# EAGLE design watch_pcb (EAGLE 9.7.0)

## Sheet 1 of 4: FTDI Serial and Battery Charger
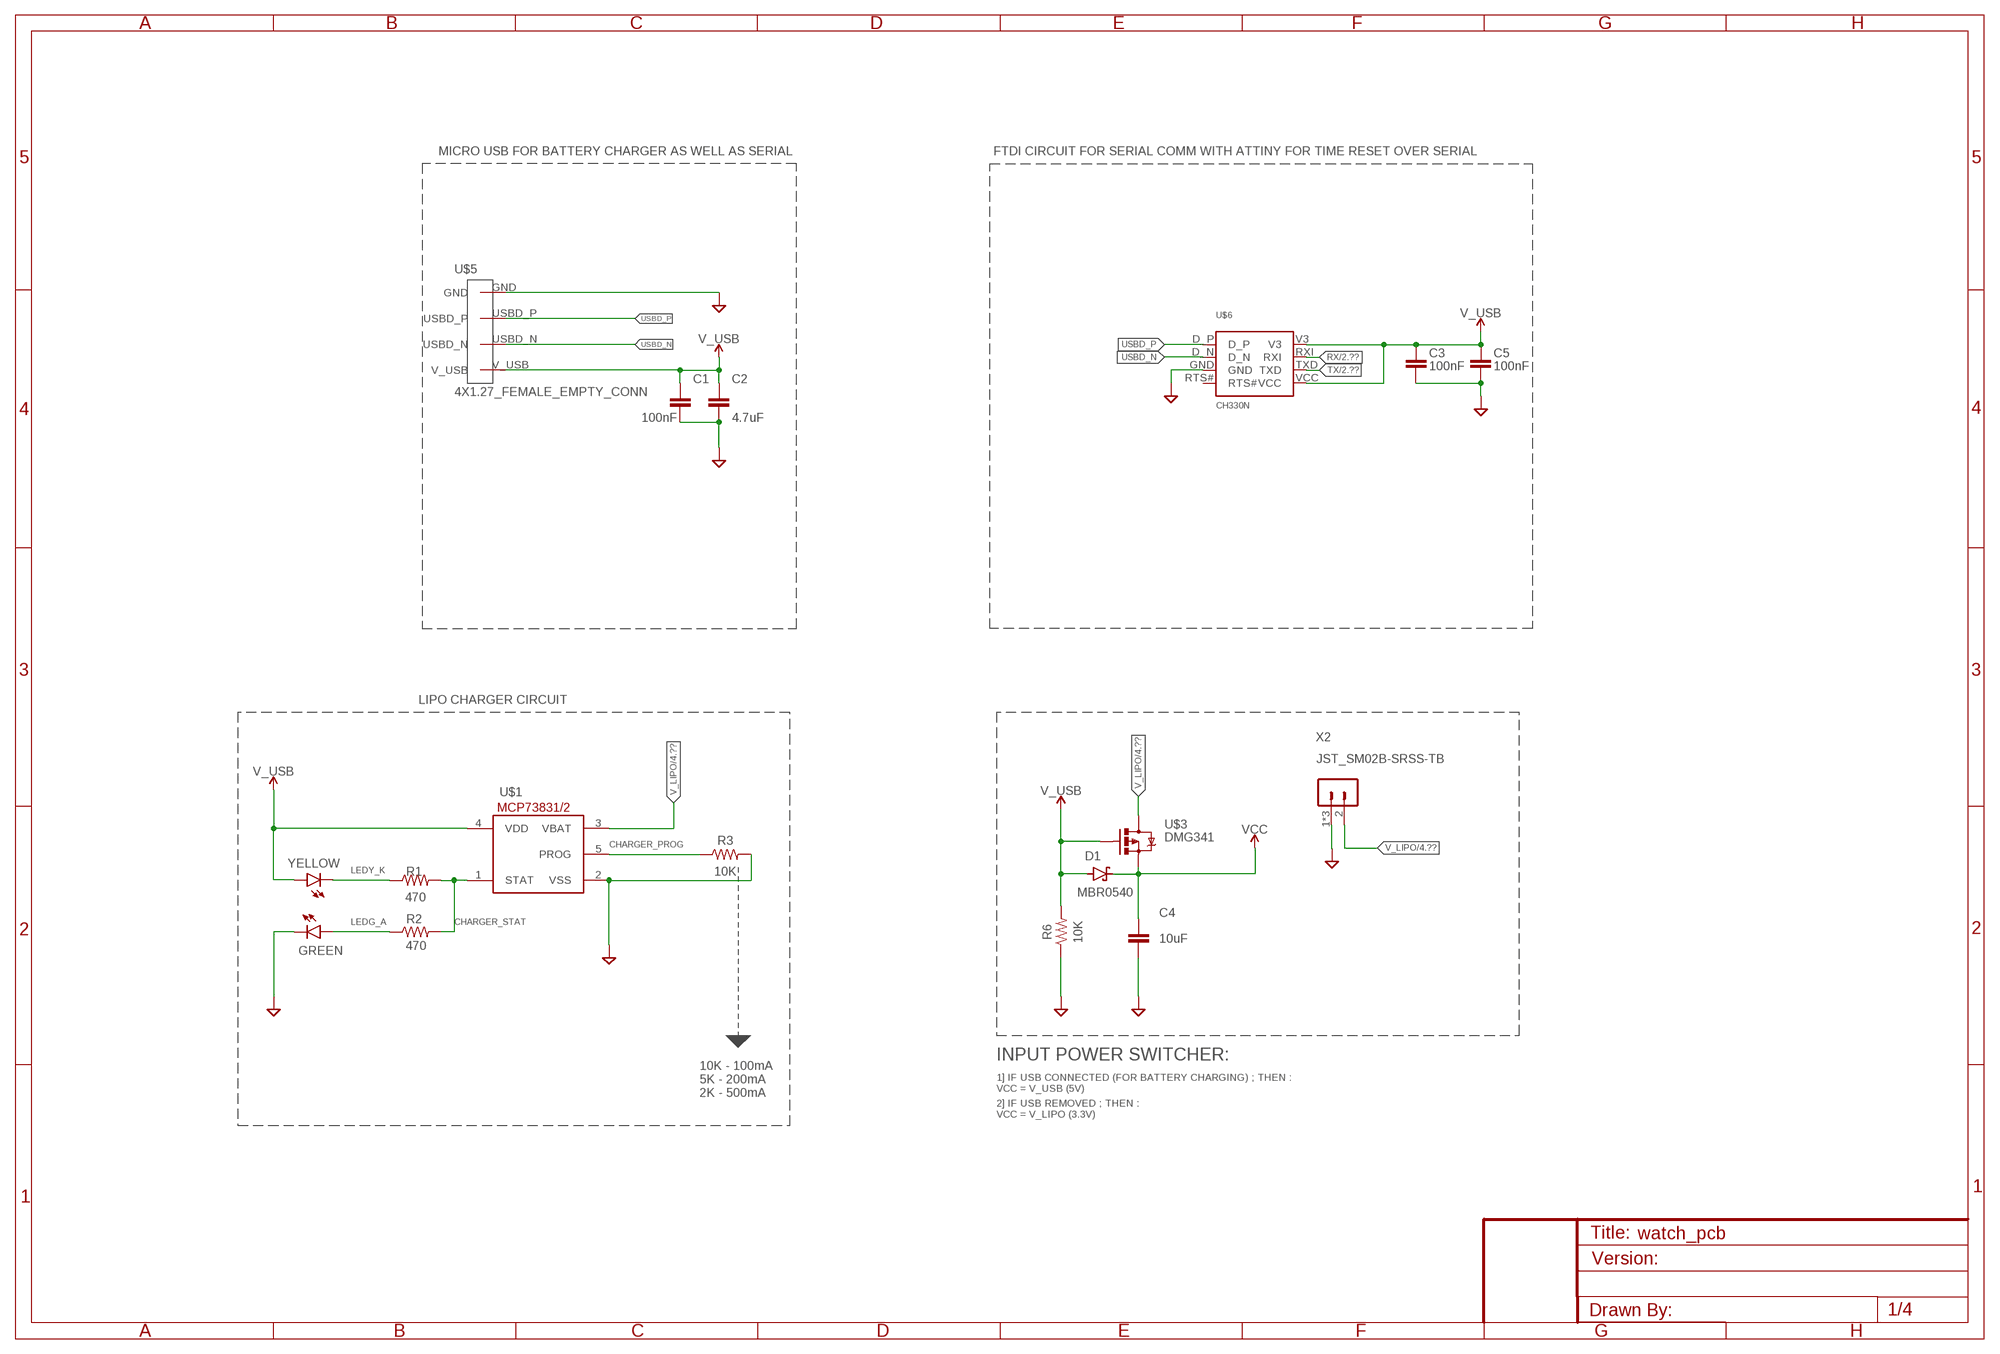
[diagram p0: schematic, sheet 1]

### Parts
C1  100nF  C_CHIP-0402(1005-METRIC)  [CAPC1005X60]
C2  4.7uF  C_CHIP-0402(1005-METRIC)  [CAPC1005X60]
C3  100nF  C_CHIP-0402(1005-METRIC)  [CAPC1005X60]
C4  10uF  C_CHIP-0402(1005-METRIC)  [CAPC1005X60]
C5  100nF  C_CHIP-0402(1005-METRIC)  [CAPC1005X60]
D1  MBR0540  MBR0520LT1G  [SOD-123]
GREEN  GREEN  2MMLED_GREEN  [2MMLED_GREEN]
R1  470  R-US_CHIP-0402(1005-METRIC)  [RESC1005X40]
R2  470  R-US_CHIP-0402(1005-METRIC)  [RESC1005X40]
R3  10K  R-US_CHIP-0402(1005-METRIC)  [RESC1005X40]
R6  10K  R-US_CHIP-0402(1005-METRIC)  [RESC1005X40]
U$1  MCP73831/2_LIPO_CHARGER  [MCP73831_SOT23-5L]
U$3  DMG341  DMG341-P_CHANNEL_MOSFET-SOT23  [DMG341-P_CHANNEL_MOSFET-SOT23]
U$5  4X1.27_FEMALE_EMPTY_CONN  [4X1.27_FEMALE_EMPTY_CONN-BACKUP]
U$6  CH330N  [CH330N]
X2  JST_SM02B-SRSS-TB  [JST-SM02B-SRSS-TB]
YELLOW  ORANGE  2MMLED_YELLOW  [2MMLED_YELLOW]

### Nets
CHARGER_PROG: R3.1 U$1.5(PROG)
CHARGER_STAT: R1.2 R2.2 U$1.1(STAT)
GND: C1.2 C2.2 C3.2 C4.2 C5.2 GREEN.K(C) R3.2 R6.1 U$1.2(VSS) U$5.GND U$6.GND X2.1 X2.M1 X2.M2 ; also sheet 2,3,4
LEDG_A: GREEN.A R2.1
LEDY_K: R1.1 YELLOW.K(C)
RX: U$6.RXI ; also sheet 2
TX: U$6.TXD ; also sheet 2
USBD_N: U$5.USBD_N U$6.D_N
USBD_P: U$5.USBD_P U$6.D_P
V_LIPO: U$1.3(VBAT) U$3.3(D) X2.2 ; also sheet 4
V_USB: C1.1 C2.1 C3.1 C5.1 D1.A R6.2 U$1.4(VDD) U$3.1(G) U$5.V_USB U$6.V3 U$6.VCC YELLOW.A ; also sheet 4
VCC: C4.1 D1.C U$3.2(S) ; also sheet 2,3,4
Unconnected: U$6.RTS#

### Notes on the sheet
- MICRO USB FOR BATTERY CHARGER AS WELL AS SERIAL | FTDI CIRCUIT FOR SERIAL COMM WITH ATTINY FOR TIME RESET OVER SERIAL
- LIPO CHARGER CIRCUIT
- INPUT POWER SWITCHER:
- 10K - 100mA
  5K - 200mA
  2K - 500mA
- 1] IF USB CONNECTED (FOR BATTERY CHARGING) ; THEN :
  VCC = V_USB (5V)
- 2] IF USB REMOVED ; THEN :
  VCC = V_LIPO (3.3V)

## Sheet 2 of 4
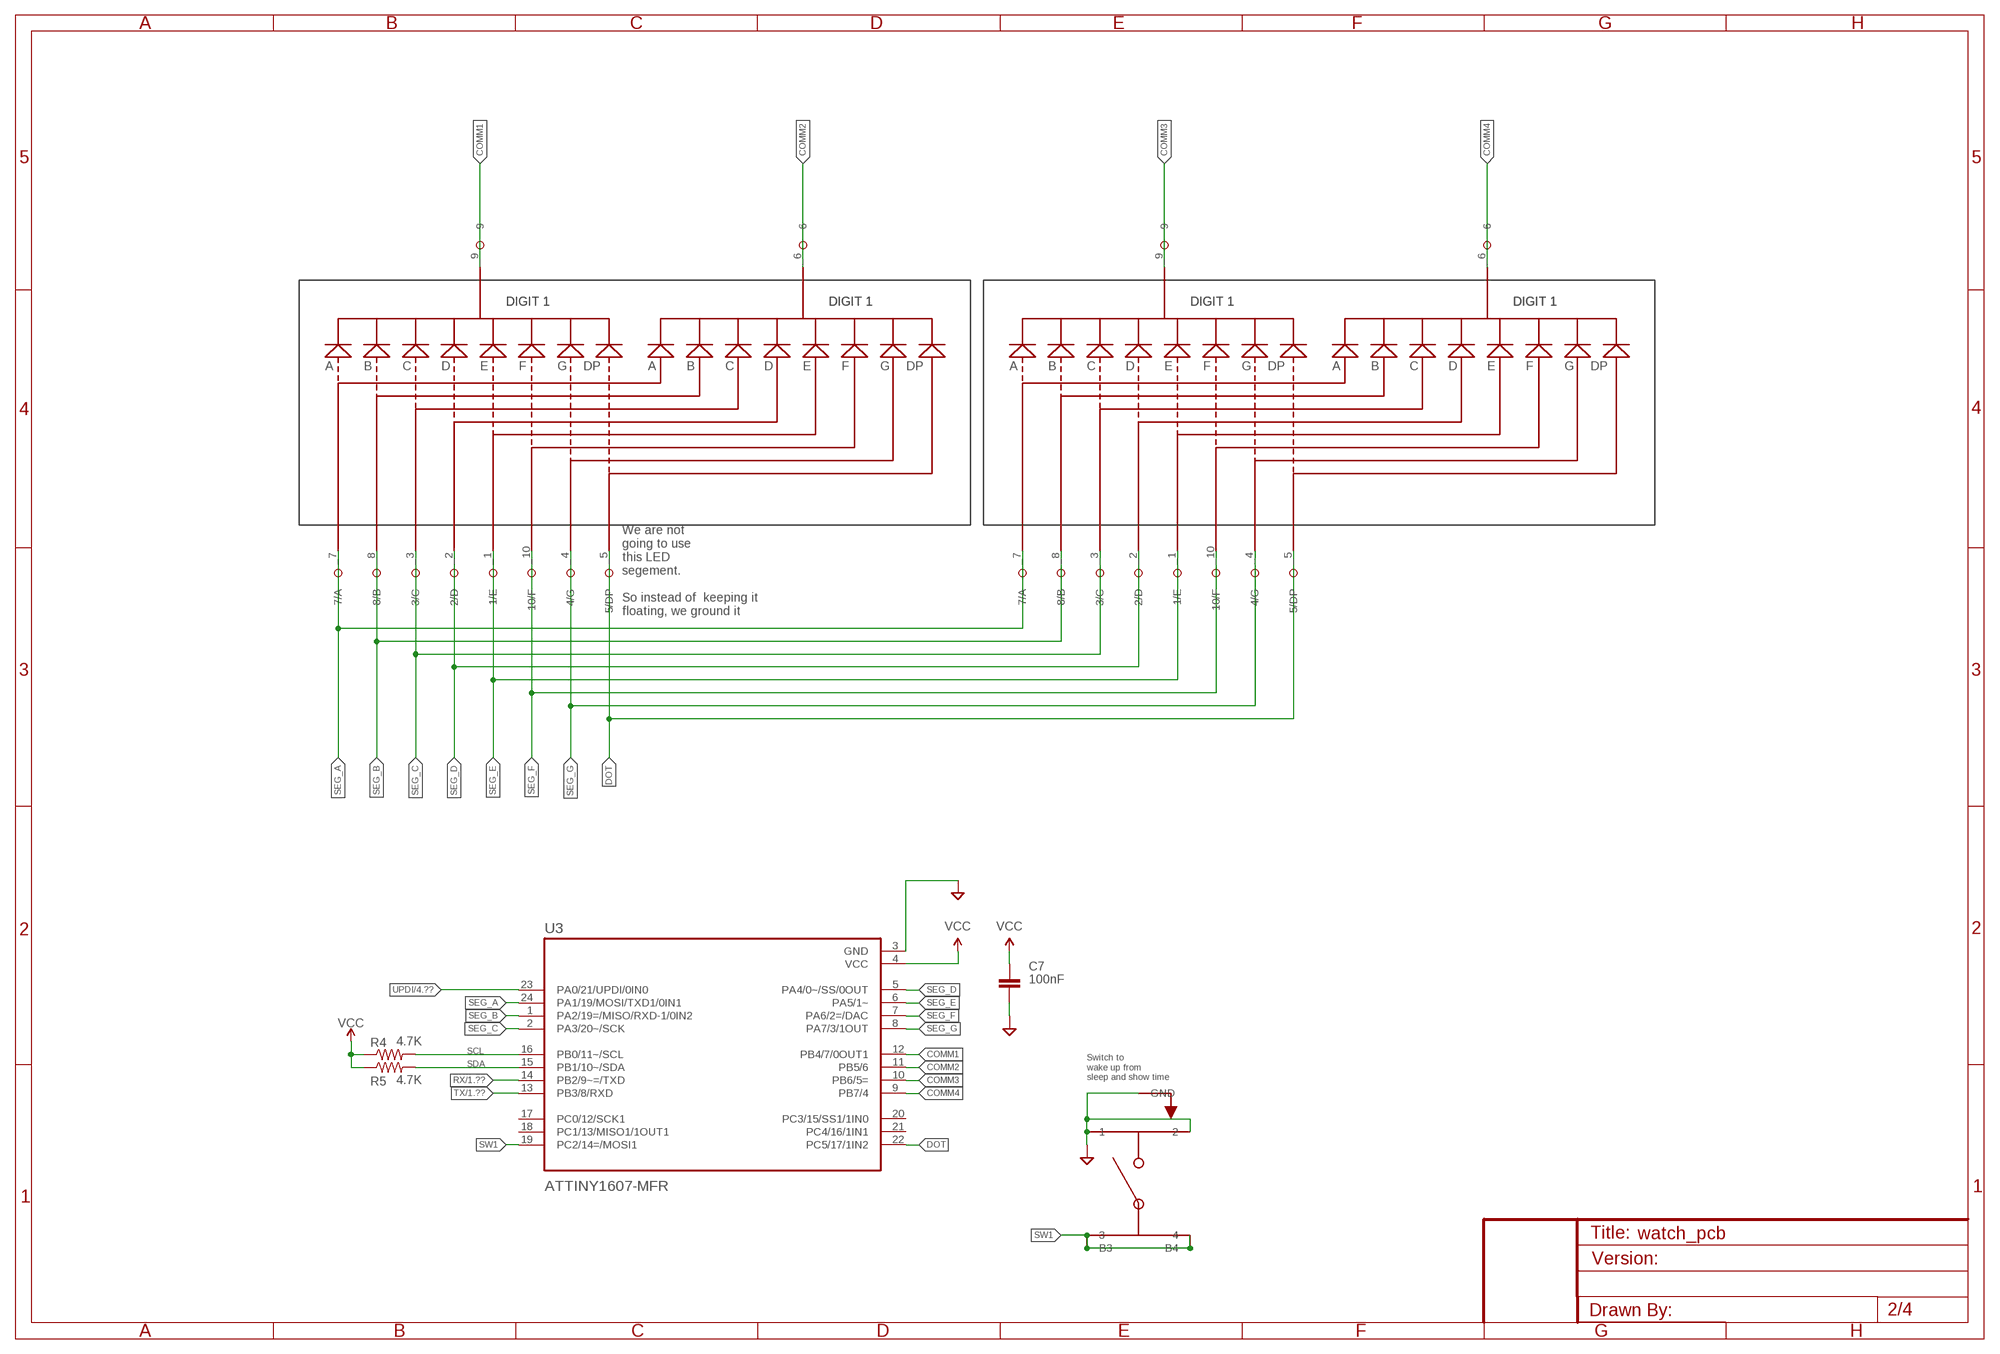
[diagram p1: schematic, sheet 2]

### Parts
BOT  0.28-2DIGIT-7SEGEMNT  [2_DIGIT_0.28]
C7  100nF  C_CHIP-0402(1005-METRIC)  [CAPC1005X60]
R4  4.7K  ADAFRUIT_R-US_R0402  [ADAFRUIT_R0402]
R5  4.7K  ADAFRUIT_R-US_R0402  [ADAFRUIT_R0402]
TOP  0.28-2DIGIT-7SEGEMNT  [2_DIGIT_0.28]
U3  ATTINY1607-MFR  ATTINY1607-MNR  [QFN50P400X400X90-25N]
U$4  PTS840ESDPMSMTRLF  [PTS840ESDPMSMTRLF]

### Nets
COMM1: TOP._9 U3.12(PB4/7/0OUT1)
COMM2: TOP._6 U3.11(PB5/6)
COMM3: BOT._9 U3.10(PB6/5=)
COMM4: BOT._6 U3.9(PB7/4)
DOT: BOT._5(5/DP) TOP._5(5/DP) U3.22(PC5/17/1IN2)
GND: C7.2 U3.3(GND) U$4.1 U$4.2 U$4.5(GND) ; also sheet 1,3,4
RX: U3.14(PB2/9~=/TXD) ; also sheet 1
SCL: R4.2 U3.16(PB0/11~/SCL) ; also sheet 3
SDA: R5.2 U3.15(PB1/10~/SDA) ; also sheet 3
SEG_A: BOT._7(7/A) TOP._7(7/A) U3.24(PA1/19/MOSI/TXD1/0IN1)
SEG_B: BOT._8(8/B) TOP._8(8/B) U3.1(PA2/19=/MISO/RXD-1/0IN2)
SEG_C: BOT._3(3/C) TOP._3(3/C) U3.2(PA3/20~/SCK)
SEG_D: BOT._2(2/D) TOP._2(2/D) U3.5(PA4/0~/SS/0OUT)
SEG_E: BOT._1(1/E) TOP._1(1/E) U3.6(PA5/1~)
SEG_F: BOT._10(10/F) TOP._10(10/F) U3.7(PA6/2=/DAC)
SEG_G: BOT._4(4/G) TOP._4(4/G) U3.8(PA7/3/1OUT)
SW1: U3.19(PC2/14=/MOSI1) U$4.3 U$4.4 U$4.B3 U$4.B4
TX: U3.13(PB3/8/RXD) ; also sheet 1
UPDI: U3.23(PA0/21/UPDI/0IN0) ; also sheet 4
VCC: C7.1 R4.1 R5.1 U3.4(VCC) ; also sheet 1,3,4
Unconnected: U3.17(PC0/12/SCK1) U3.18(PC1/13/MISO1/1OUT1) U3.20(PC3/15/SS1/1IN0) U3.21(PC4/16/1IN1)

### Notes on the sheet
- We are not
  going to use
  this LED
  segement. 
  
  So instead of  keeping it
  floating, we ground it
- Switch to 
  wake up from 
  sleep and show time

## Sheet 3 of 4: RV8803 RTC
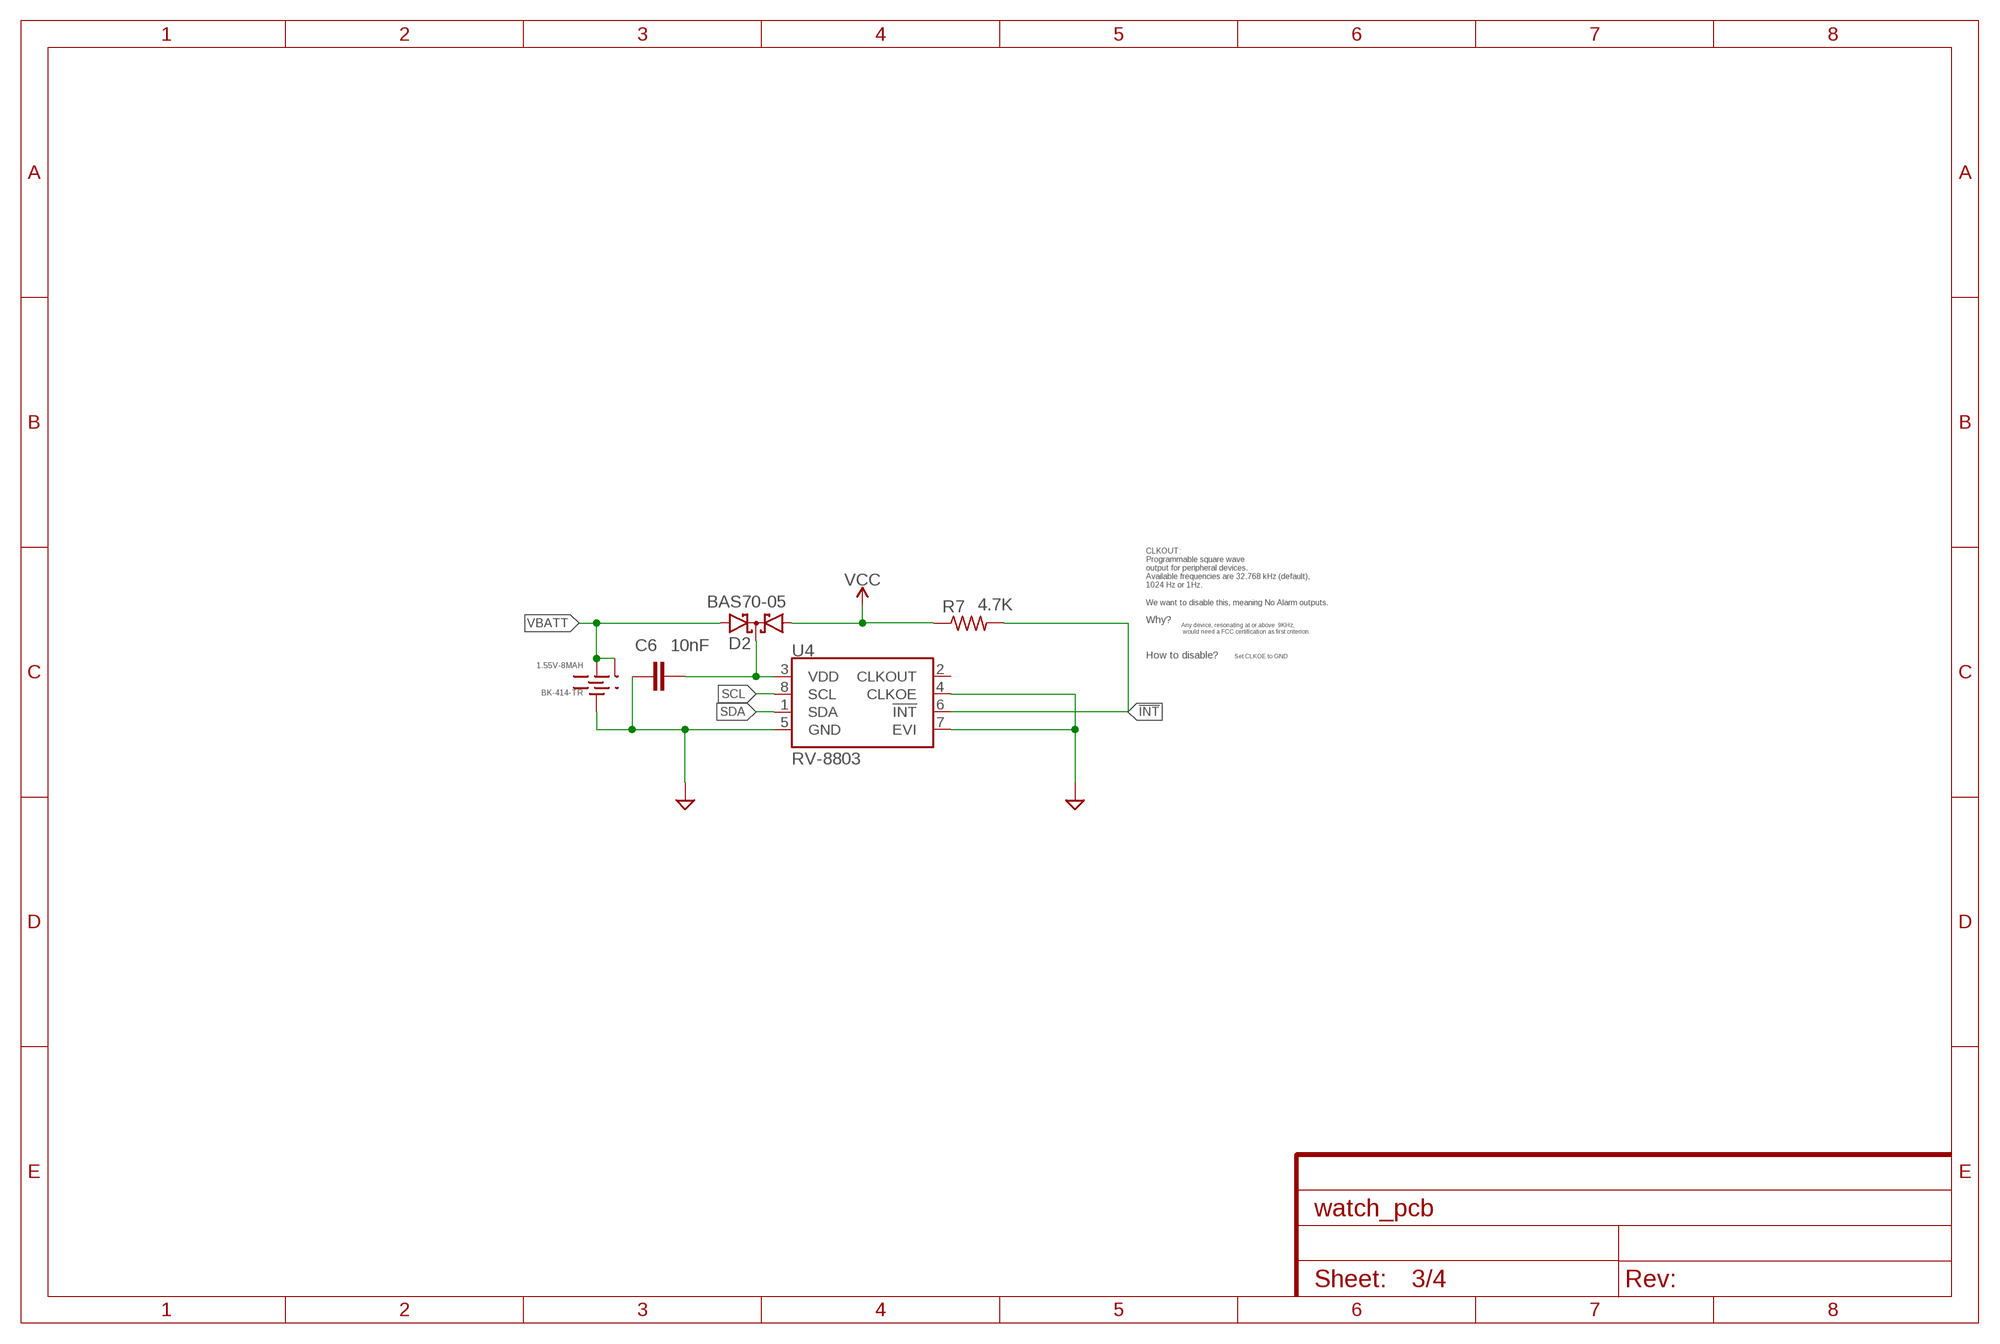
[diagram p2: schematic, sheet 3]

### Parts
1.55V-8MAH  BK-414-TR  [BK-414-TR]
C6  10nF  10NF-0402T-25V-10%  [0402-TIGHT]
D2  BAS70-05  [SOT23]
R7  4.7K  ADAFRUIT_R-US_R0402  [ADAFRUIT_R0402]
U4  RV-8803  [RV-3028]

### Nets
!INT: R7.2 U4.6(!INT)
GND: 1.55V-8MAH.-(_GND) C6.2 U4.4(CLKOE) U4.5(GND) U4.7(EVI) ; also sheet 1,2,4
SCL: U4.8(SCL) ; also sheet 2
SDA: U4.1(SDA) ; also sheet 2
VBATT: 1.55V-8MAH.1+(VOUT) 1.55V-8MAH.2+(VOUT2) D2.2(A2)
VCC: D2.1(A1) R7.1 ; also sheet 1,2,4
VDD1: C6.1 D2.3(C) U4.3(VDD)
Unconnected: U4.2(CLKOUT)

### Notes on the sheet
- CLKOUT: 
  Programmable square wave 
  output for peripheral devices.
  Available frequencies are 32.768 kHz (default),
  1024 Hz or 1Hz.
- We want to disable this, meaning No Alarm outputs.
- Why?
- Any device, resonating at or above  9KHz,
   would need a FCC certification as first criterion.
- How to disable? | Set CLKOE to GND

## Sheet 4 of 4
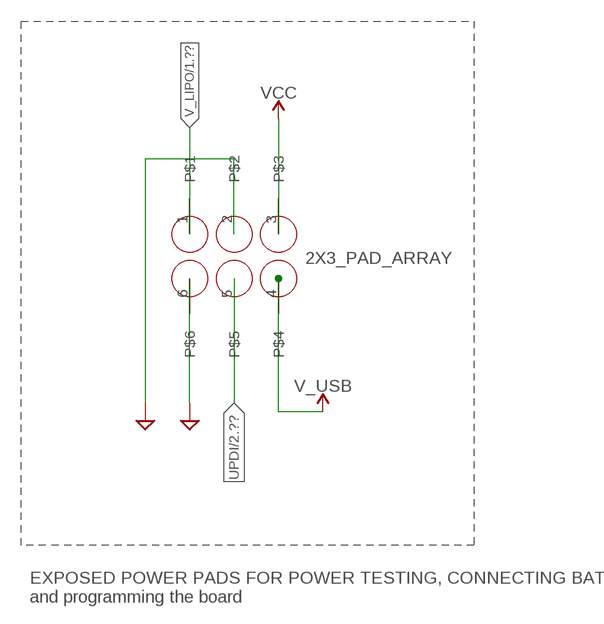
[diagram p3: schematic, sheet 4]

### Parts
U$2  2X3_PAD_ARRAY  [2X3_PAD_ARRAY]

### Nets
GND: U$2.2 U$2.6 ; also sheet 1,2,3
UPDI: U$2.5 ; also sheet 2
V_LIPO: U$2.1 ; also sheet 1
V_USB: U$2.4 ; also sheet 1
VCC: U$2.3 ; also sheet 1,2,3

### Notes on the sheet
- EXPOSED POWER PADS FOR POWER TESTING, CONNECTING BATTERY 
  and programming the board

## Library data of the parts
1.55V-8MAH = MY_CLOCK_LIB_COMPONENTS:BK-414-TR
BOT TOP = MY_CLOCK_LIB_COMPONENTS:0.28-2DIGIT-7SEGEMNT
C1-C5 C7 = MY_CAP_LIB:C: Capacitor - Generic; CATEGORY: Capacitor
C6 = SparkFun-Capacitors:10NF: 0.01uF/10nF/10,000pF ceramic capacitors A capacitor is a passive two-terminal electrical component used to store electrical energy temporarily in an electric field. CAP-09321; PROD_ID: CAP-14847
D1 = Diodes:MBR0520LT1G: DIODE SCHOTTKY 20V 500MA SOD123 Manufacturer's datasheet <https://www.onsemi.com/pub/Collateral/MBR0520LT1-D.PDF>; CREATED_BY: PCBLayout.com; DIGIKEY_PART_NUMBER: MBR0520LT1GOSTR-ND; MANUFACTURER: ON Semiconductor; MPN: MBR0520LT1G; PACKAGE: SOD-123
D2 = BAS_40_05:BAS70-05: Silicon Schottky Diodes General-purpose diode for high-speed switching
GREEN = MY_CLOCK_LIB_COMPONENTS:2MMLED_GREEN
R1-R3 R6 = resistor:R-US: Resistor Fixed - ANSI; CATEGORY: Resistor; SUB-CATEGORY: Fixed
R4 R5 R7 = ARDUINO_3V_TTL_INTERFACE_2_PI:ADAFRUIT_R-US_: RESISTOR, American symbol
U3 = ATTINY1607-MNR:ATTINY1607-MNR: None Check prices <https://pricing.snapeda.com/parts/ATTINY1607-MNR/Microchip%20Technology/view-part?ref=eda>; AVAILABILITY: In Stock; DESCRIPTION: AVR AVR® ATtiny, Functional Safety (FuSa) Microcontroller IC 8-Bit 20MHz 16KB (16K x 8) FLASH 24-VQFN (4x4); MF: Microchip Technology; MP: ATTINY1607-MNR; PACKAGE: VFQFN-24 Microchip Technology; PRICE: None
U4 = RV-8803:RV-8803: Micro Crystal RV-8803 - Temperature compensated RTC Ultra accurate plus/minus 3PPM I2C RTC. Temperature compensated crystal for low drift; PROD_ID: IC-14828
U$1 = MY_CLOCK_LIB_COMPONENTS:MCP73831/2_LIPO_CHARGER
U$2 = MY_CLOCK_LIB_COMPONENTS:2X3_PAD_ARRAY
U$3 = MY_CLOCK_LIB_COMPONENTS:DMG341-P_CHANNEL_MOSFET-SOT23
U$4 = MY_CLOCK_LIB_COMPONENTS:PTS840ESDPMSMTRLF
U$5 = MY_CLOCK_LIB_COMPONENTS:4X1.27_FEMALE_EMPTY_CONN
U$6 = MY_CLOCK_LIB_COMPONENTS:CH330N
X2 = MY_CLOCK_LIB_COMPONENTS:JST_SM02B-SRSS-TB
YELLOW = MY_CLOCK_LIB_COMPONENTS:2MMLED_YELLOW

## Board
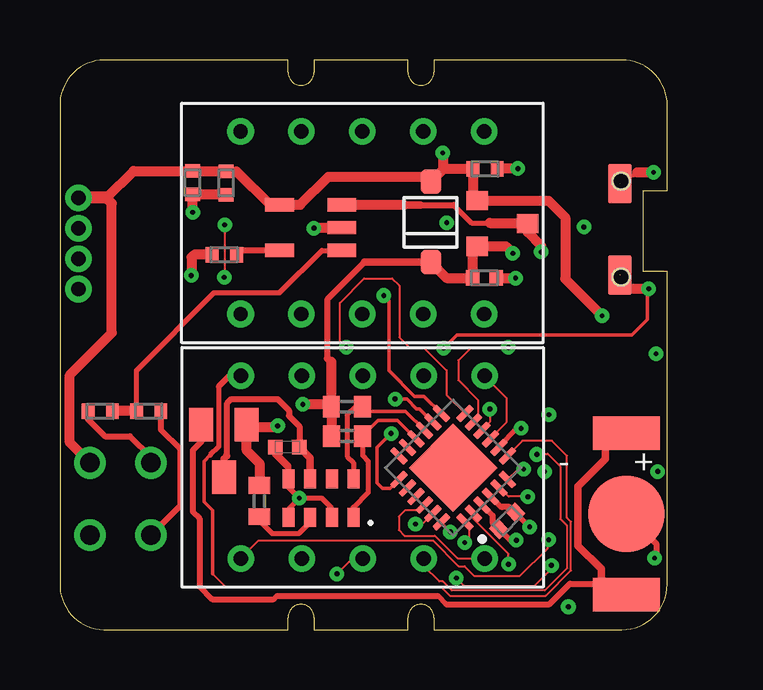
[diagram p4: board, top side]
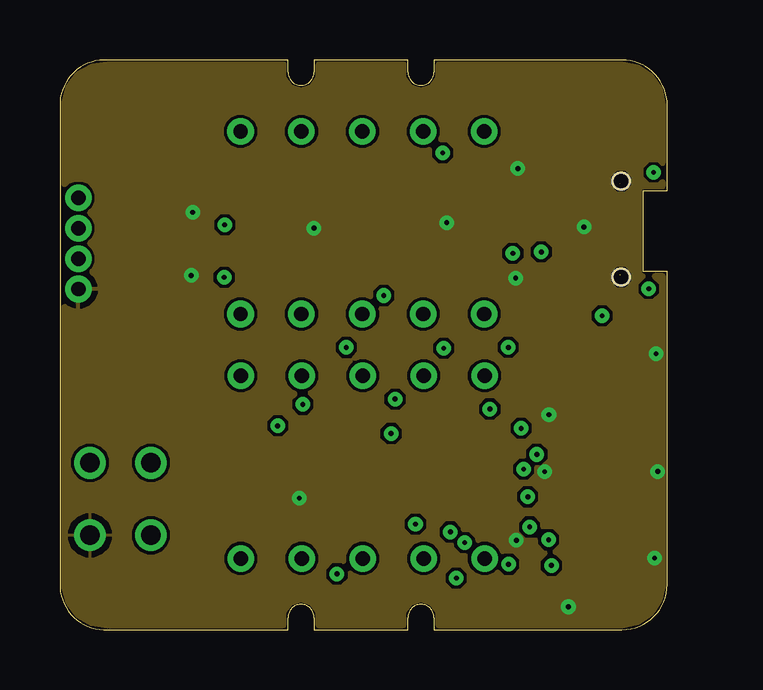
[diagram p5: board, inner layer pw_plane_t]
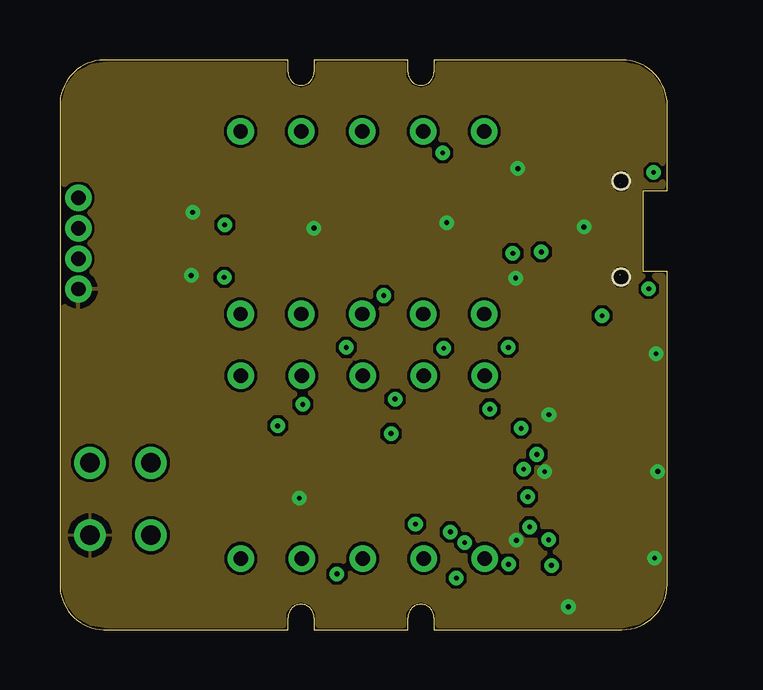
[diagram p6: board, inner layer pwr_plane_b]
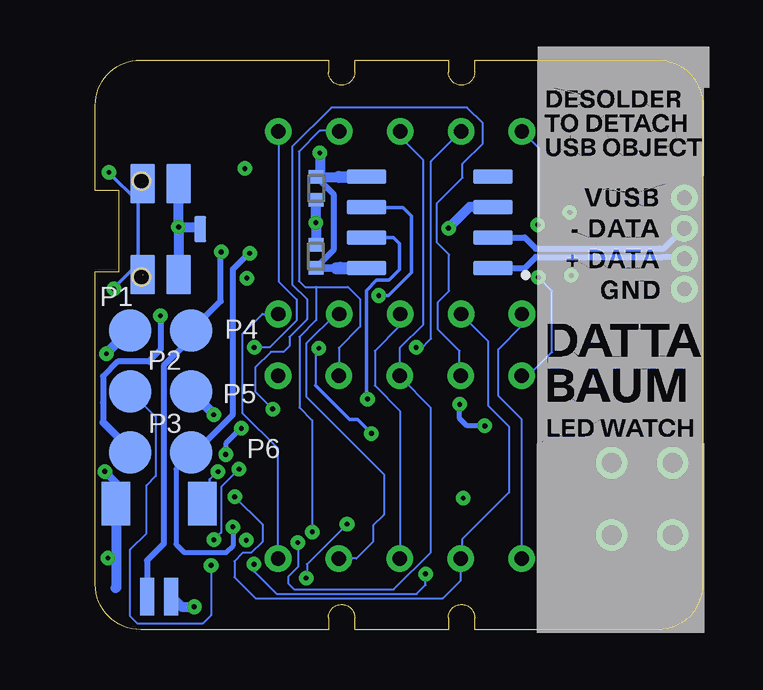
[diagram p7: board, bottom side, seen from below]

Size 25.32 x 23.76 mm. Coordinates in mm from the lower left corner, seen from the top.
Outline: 9.5,23.25 9.5,23.75 2,23.75 arc90 0,22 0,1.75 arc90 2,0 9.5,0 9.5,0.5 arc-180 10.6,0.5 10.6,0 14.5,0 14.5,0.5 arc-180 15.6,0.5 15.6,0 23.44,0 arc90 25.32,1.88 25.32,14.93 24.32,14.93 24.32,18.3 25.32,18.3 25.32,21.87 arc90 23.44,23.75 15.6,23.75 15.6,23.25 arc-180 14.5,23.25 14.5,23.75 10.6,23.75 10.6,23.25 arc-180 9.5,23.25
Copper layers (1+2*15+16): Top 0.035mm / dielectric 0.2mm / pw_plane_t 0.0175mm / dielectric 1.065mm / pwr_plane_b 0.0175mm / dielectric 0.2mm / Bottom 0.035mm
Design rules "jlc_pcb_4_layer *": minimum track width 0.09mm, minimum drill 0.2mm, track to track 0.09mm, track to pad 5mil, pad to pad 5mil, via to via 5mil, smd to smd 5mil, copper to edge 2.5mil, drill to drill 5mil, minimum pad ring 10mil, minimum via ring 8mil, stop-mask expansion 4mil, vias tented up to drill 0.2mm, thermal gap 10mil

### Footprints (pad centres in the part's own frame; a part is rotated, then mirrored left to right if it is on the bottom)
BK-414-TR = smd 1.4 x 2.79: 1+ -3.365,0; 2+ 3.365,0 | smd 3.18 x 3.18: - 0,0
2_DIGIT_0.28 = drill 0.6: _1 -5.08,-3.81; _2 -2.54,-3.81; _3 0,-3.81; _4 2.54,-3.81; _5 5.08,-3.81; _6 5.08,3.81; _7 2.54,3.81; _8 0,3.81; _9 -2.54,3.81; _10 -5.08,3.81
CAPC1005X60 = smd 0.56 x 0.629: 1 -0.485,0; 2 0.485,0
0402-TIGHT = smd 0.6 x 0.6: 1 -0.5,0; 2 0.5,0
SOD-123 = smd 1.02 x 0.86: A 1.68,0; C -1.68,0
SOT23 = smd 1 x 1.4: 1 -0.95,-1.1; 2 0.95,-1.1; 3 0,1.1
2MMLED_GREEN = drill 0.813: A -1.27,0; K 1.27,0
RESC1005X40 = smd 0.535 x 0.644: 1 -0.507,0; 2 0.507,0
ADAFRUIT_R0402 = smd 0.7 x 0.9: 1 -0.65,0; 2 0.65,0
QFN50P400X400X90-25N = smd 0.81 x 0.26: 1 -1.95,1.25; 2 -1.95,0.75; 3 -1.95,0.25; 4 -1.95,-0.25; 5 -1.95,-0.75; 6 -1.95,-1.25; 13 1.95,-1.25; 14 1.95,-0.75; 15 1.95,-0.25; 16 1.95,0.25; 17 1.95,0.75; 18 1.95,1.25 | smd 0.26 x 0.81: 7 -1.25,-1.95; 8 -0.75,-1.95; 9 -0.25,-1.95; 10 0.25,-1.95; 11 0.75,-1.95; 12 1.25,-1.95; 19 1.25,1.95; 20 0.75,1.95; 21 0.25,1.95; 22 -0.25,1.95; 23 -0.75,1.95; 24 -1.25,1.95 | smd 2.6 x 2.6: 25 0,0
RV-3028 = smd 0.5 x 0.8: 1 -1.35,-0.8; 2 -0.45,-0.8; 3 0.45,-0.8; 4 1.35,-0.8; 5 1.35,0.8; 6 0.45,0.8; 7 -0.45,0.8; 8 -1.35,0.8
MCP73831_SOT23-5L = smd 0.55 x 1.2: 1 -0.95,-1.3; 2 0,-1.3; 3 0.95,-1.3; 4 0.95,1.3; 5 -0.95,1.3
2X3_PAD_ARRAY = smd 1.778 x 1.778: 1 0,0; 2 2.54,0; 3 5.08,0; 4 5.08,-2.54; 5 2.54,-2.54; 6 0,-2.54
DMG341-P_CHANNEL_MOSFET-SOT23 = smd 0.8 x 0.9: 1 -0.95,-1; 2 0.95,-1; 3 0,1.1
PTS840ESDPMSMTRLF = smd 1.65 x 1: 1 -1.9,0.75; 2 1.9,0.75; 3 -1.9,-0.75; 4 1.9,-0.75 | smd 1.1 x 0.5: 5 0,1.65 | smd 1.65 x 1 bottom: B3 -1.89,-0.745; B4 1.91,-0.745 | hole 0.7: -2,-0.8; 2,-0.8
4X1.27_FEMALE_EMPTY_CONN-BACKUP = drill 0.6 pad 0.9: GND 0,0; USBD_N 0,2.54; USBD_P 0,1.27; V_USB 0,3.81
CH330N = smd 1.64 x 0.59: D_N -2.635,0.635; D_P -2.635,1.905; GND -2.635,-0.635; RTS# -2.635,-1.905; RXI 2.635,0.635; TXD 2.635,-0.635; V3 2.635,1.905; VCC 2.635,-1.905
JST-SM02B-SRSS-TB = smd 0.6 x 1.55: 1 0.5,0; 2 -0.5,0 | smd 1.2 x 1.8: M1 1.8,3.875; M2 -1.8,3.875
2MMLED_YELLOW = drill 0.813: A -1.27,0; K 1.27,0

### Placement (x,y rotation side)
1.55V-8MAH  23.61,4.83 270 top
BOT  12.62,6.78 0 top
C1  5.52,18.64 270 top
C2  6.93,18.63 270 top
C3  16.12,15.57 90 bottom
C4  17.7,14.67 0 top
C5  16.11,18.4 270 bottom
C6  9.49,7.62 180 top
C7  18.65,4.54 225 top
D1  15.46,17 90 top
D2  6.84,7.45 180 top
GREEN  2.52,3.94 180 top
R1  1.68,9.1 0 top
R2  3.7,9.11 180 top
R3  6.85,15.64 180 top
R4  11.97,8.08 0 top
R5  11.96,9.3 0 top
R6  17.72,19.21 180 top
R7  8.32,5.36 270 top
TOP  12.61,16.97 0 top
U3  16.39,6.76 135 top
U4  10.89,5.49 180 top
U$1  10.45,16.77 90 top
U$2  21.32,12.48 270 bottom
U$3  18.4,16.94 270 top
U$4  22.6,16.71 270 bottom
U$5  0.76,14.2 0 top
U$6  11.38,16.99 180 bottom
X2  22.66,1.38 0 bottom
YELLOW  2.52,6.96 0 top

### Tracks (layer width: path | path; a pad name or v marks a point on that pad's centre or on a via)
!INT
  Top 0.2: R7.2 8.32,4.54 8.84,4.01 9.96,4.01 10.44,4.49 U4.6
CHARGER_PROG
  Top 0.254: R3.1 7.54,15.82 U$1.5
CHARGER_STAT
  Top 0.2: R2.2 3.19,10.81 6.43,14.05 9.16,14.05 10.92,15.82 U$1.1
  Top 0.406: R1.2 2.2,9.11 R2.2
COMM1  (via drill 0.2)
  Top 0.09: v11.94,11.77 11.67,12.04 11.67,13.63 12.69,14.64 13.85,14.64 14.15,14.35 14.15,12.19 14.57,11.78 15.15,11.78 16.12,10.81 16.12,9.79 16.88,9.03 U3.12
  Bottom 0.09: v11.94,11.77 11.82,11.65 11.81,11.65 11.32,12.14 11.32,19.54 TOP._9
COMM2  (via drill 0.2)
  Top 0.09: v18.69,11.77 17.15,11.77 16.61,11.23 16.61,10.41 17.43,9.59 17.43,8.85 17.25,8.68 U3.11
  Bottom 0.09: TOP._6 17.68,20.78 17.68,14.52 16.93,13.77 16.93,12.9 18.05,11.77 v18.69,11.77
COMM3  (via drill 0.2)
  Top 0.09: v17.93,9.2 17.93,8.65 17.6,8.33 U3.10
  Bottom 0.09: BOT._9 10.16,10.67 10.13,10.7 10.13,11.62 11.02,12.51 11.02,13.67 10.57,14.13 10.57,15.64 11.07,16.14 11.07,17.78 10.01,18.85 10.01,19.43 9.17,20.27 9.17,21.12 9.81,21.77 15.47,21.77 17.11,20.14 17.11,14.4 16.49,13.78 16.49,12.94 17.22,12.21 17.22,11.83 17.46,11.59 18,11.59 18.66,10.92 18.66,9.93 v17.93,9.2
COMM4
  Top 0.09: U3.9 17.95,7.98 18.62,8.64 18.62,9.66 17.7,10.58 BOT._6
DOT
  Top 0.09: BOT._5 16.57,2.98 15.63,3.92 14.36,3.92 14.13,4.15 14.13,4.72 14.38,4.97 14.96,4.97 U3.22
  Bottom 0.09: TOP._5 18.35,13.16 19.17,12.35 19.17,9.02 17.7,7.55 BOT._5
GND  (via drill 0.2)
  Top 0.102: v24.79,2.99 24.88,2.99
  Top 0.2: U3.3 18.04,4.75 18.05,4.75 | C7.2 18.9,3.6 v19.02,3.73 | 5.53,18.14 C1.2 | 5.49,14.77 v5.47,14.77 | 10.72,16.77 10.69,16.74 v10.59,16.74 | 18.85,14.67 18.86,14.68 18.97,14.68 v19,14.66 | R6.1 18.27,19.26 | 19.06,19.26 v19.09,19.23 | 9.98,5.53 v9.98,5.49 | v9.98,5.49 9.54,5.05 U4.5 | v9.98,5.49 10.9,5.49 11.34,5.05 U4.7 | v9.98,5.49 9.54,5.93 9.54,6.2 U4.4 9.54,6.79 9.49,6.84
  Top 0.254: 18.05,4.75 18.05,4.46 18.08,4.42 | 1.55V-8MAH.- 24.88,3.57 24.88,2.99
  Top 0.305: 18.08,4.42 C7.2 | 9.49,6.84 8.98,7.34 C6.2
  Top 0.406: C1.2 6.91,18.16 C2.2 | v5.53,17.4 5.53,18.14 | R3.2 5.6,15.64 5.49,15.52 5.49,14.77 | 10.72,16.77 U$1.2 | C4.2 18.85,14.67 | 18.27,19.26 19.06,19.26
  Bottom 0.102: X2.M2 24.46,6.13 | X2.M1 20.56,5.56 20.56,6.26 20.41,6.42 20.31,6.42 20.31,6.49 v20.2,6.59
  Bottom 0.2: 21,5.11 X2.M1 | 22.16,0.89 X2.1 | 16.12,17.91 C5.2 | 20.5,9.12 20.48,9.12 20.38,9.02 v20.38,8.97 | 23.93,12.48 U$2.6 | v24.85,11.51 24.85,11.55
  Bottom 0.305: 24.46,6.13 v24.93,6.6
  Bottom 0.406: 16.12,17.91 v16.12,16.97 C3.2 | X2.M2 24.46,1.77 24.45,1.76 24.47,1.73 | U$2.2 20.5,9.12 | v21.85,16.79 U$4.1 | U$4.5 21.03,16.79 v21.85,16.79 | v21.85,16.79 U$4.2 | 24.85,11.55 23.93,12.48 | U$6.GND 9.71,17.62 v10.59,16.74 | X2.1 21.73,0.96 v21.2,0.96
  pour pw_plane_t: -1.83,24.78 26.31,24.78 26.31,-3.97 -1.83,-3.97
  pour pwr_plane_b: -1.83,25.52 -1.83,-4.37 26.9,-4.37 26.9,25.52
LEDG_A
  Top 0.254: R2.1 4.21,8.33 5,7.53 5,5.15 GREEN.A
LEDY_K
  Top 0.254: R1.1 1.17,8.78 1.88,8.07 2.91,8.07 3.79,7.18 YELLOW.K
RX  (via drill 0.2)
  Top 0.152: v13.97,9.62 14.46,9.62 14.87,9.21 15,9.21 U3.14
  Bottom 0.152: U$6.RXI 12.88,16.35 12.64,16.11 12.64,15.01 13.08,14.57 13.6,14.57 14.02,14.14 14.02,9.85 13.88,9.71 v13.97,9.62
SCL
  Top 0.152: R4.2 13.27,8.73 14.07,8.73 U3.16
  Top 0.2: R4.2 12.62,7.26 12.85,7.03 12.85,5.72 12.23,5.1 U4.8 | U3.16
SDA
  Top 0.152: U3.15 14.41,9.1 12.81,9.1 R5.2
  Top 0.2: R5.2 12.32,9.3 11.97,8.95 11.97,7.23 12.23,6.97 U4.1
SEG_A  (via drill 0.2)
  Top 0.09: v16.27,4.08 16.27,4.1 15.9,4.48 U3.24
  Bottom 0.09: 15.18,20.81 15.96,20.81 16.83,19.94 16.83,14.54 16.58,14.29 16.11,14.29 | 16.11,14.29 14.78,14.29 14.27,13.78 14.27,12.64 15.16,11.75 BOT._7 | v16.27,4.08 16.27,8.73 16.81,9.26 16.81,12.21 16.11,12.9 16.11,14.29
  Bottom 0.152: 15.18,20.81 TOP._7
SEG_B  (via drill 0.2)
  Top 0.09: v16.88,3.63 17.05,3.81 17.05,4.33 U3.1
  Bottom 0.09: 12.61,20.55 11.64,19.59 11.64,12.73 12.62,11.76 BOT._8 12.6,10.53 11.33,9.26 11.33,3.23 12.88,1.67 17.03,1.67 17.28,1.93 17.28,2.21 16.88,2.61 v16.88,3.63
  Bottom 0.152: 12.61,20.55 TOP._8
SEG_C  (via drill 0.2)
  Top 0.09: v11.55,2.33 12.18,2.95 12.6,2.95 BOT._3 | U3.2 17.24,4.62 18.7,3.16 v18.7,2.73
  Bottom 0.09: 12.61,12.68 13.66,11.62 13.66,10.18 12.62,9.13 BOT._3 | v11.55,2.33 11.55,1.87 11.93,1.49 17.76,1.49 18.7,2.43 v18.7,2.73
  Bottom 0.152: 12.61,12.68 TOP._3
SEG_D  (via drill 0.2)
  Top 0.09: U3.5 18.35,5.91 18.71,5.55 19.49,5.55 v19.51,5.54
  Bottom 0.09: 10.03,3.03 10.03,3.76 8.06,5.72 8.06,8.47 8.94,9.35 8.94,12.03 TOP._2 | BOT._2 10.08,2.06 10.82,1.31 18.64,1.31 19.51,2.19 19.51,2.86 19.17,3.21 18.82,3.21 18.35,3.67 18.35,4.38 v19.51,5.54
  Bottom 0.2: 10.03,3.03 BOT._2
SEG_E  (via drill 0.2)
  Top 0.09: v20.37,3.75 20.31,3.69 20.31,3.38 19.16,2.23 17.29,2.23 16.87,2.64 16.62,2.64 15.54,3.72 8.28,3.72 BOT._1 | U3.6 19.06,6.67 19.3,6.67 v19.33,6.7
  Bottom 0.09: BOT._1 7.54,8.78 8.52,9.76 8.52,11.69 7.53,12.68 | v20.37,3.75 v20.37,3.76 20.07,4.06 20.07,5.95 v19.33,6.7
  Bottom 0.152: 7.53,12.68 TOP._1
SEG_F  (via drill 0.2)
  Top 0.09: BOT._10 7.07,10.59 | U3.7 19.28,7.87 20.51,7.87 21.14,7.25 21.14,4.67 21.31,4.5 21.31,2.47 20.25,1.42 16.25,1.42 15.9,1.77 6.93,1.77 6.36,2.34 | v6.87,16.88 6.87,14.72 v6.84,14.7
  Top 0.152: 6.27,7.28 6.01,7.02 6.01,5.34 6.36,4.98 6.36,2.34
  Top 0.2: 6.62,10.14 6.62,7.63 6.27,7.28
  Top 0.254: 7.07,10.59 6.62,10.14
  Bottom 0.09: TOP._10 6.83,20.09 6.83,16.92 v6.87,16.88 | 7.25,10.59 6.27,11.57 6.27,14.13 v6.84,14.7
  Bottom 0.152: BOT._10 7.25,10.59
SEG_G  (via drill 0.2)
  Top 0.09: 15.16,2.67 15.81,2.01 15.96,2.01 16.34,1.64 20.21,1.64 21.13,2.55 21.13,4.35 20.86,4.62 20.86,6.82 20.34,7.33 19.95,7.33
  Top 0.127: 15.16,2.67 BOT._4 | 19.95,7.33 19.94,7.33 19.92,7.31 v19.88,7.31
  Top 0.2: v19.23,8.4 19.21,8.38 19.04,8.38 18.3,7.65 U3.8
  Bottom 0.09: 15.29,13.16 16.51,11.95 16.51,9.7 13.29,6.48 13.29,4.79 13.73,4.34 13.73,3.67 14.43,2.97 BOT._4
  Bottom 0.152: TOP._4 15.29,13.16
  Bottom 0.2: v19.23,8.4 19.25,8.4 19.88,7.77 v19.88,7.31
SW1  (via drill 0.2)  (2 unrouted)
  Top 0.152: 15.91,11.55 16,11.64 v16,11.74 16.54,12.28 23.85,12.28 24.5,12.93 24.5,14.22 v24.55,14.22 v24.55,14.21 | 24.07,19.07 23.93,18.93 23.67,18.93 U$4.B3 | 23.92,14.22 U$4.B4 | 13.8,7.98 v13.8,8.18 13.22,7.6 13.22,6.11 13.45,5.88 13.75,5.88 U3.19
  Top 0.406: v24.75,19.07 24.07,19.07 | 23.92,14.22 24.5,14.22
  Bottom 0.09: 16.14,10.19 16.14,11.6 v16,11.74
  Bottom 0.152: v24.55,14.21 24.57,14.23 23.53,15.26 23.53,17.85 v24.75,19.07 | 16.14,10.19 14.72,8.77 14.39,8.77 v13.8,8.18
TX  (via drill 0.2)
  Top 0.152: v13.5,13.93 13.71,13.72 13.71,10.8 14.79,9.73 15.19,9.73 U3.13
  Bottom 0.152: U$6.TXD 14,17.61 12.48,17.61 12.13,17.25 12.13,14.9 13.09,13.93 v13.5,13.93
UPDI  (via drill 0.2)
  Top 0.09: U3.23 14.93,4.23 14.92,4.23 14.92,4.3 v14.82,4.4 | v16.53,2.15 16.84,1.83 19.79,1.83 20.49,2.54 v20.49,2.68
  Bottom 0.09: v14.82,4.4 16.49,2.73 16.49,2.18 v16.53,2.15 | U$2.5 22.8,8.87 22.8,6.41 23.18,6.02 23.18,4.03 23.86,3.35 23.86,0.55 23.56,0.26 20.84,0.26 20.49,0.61 v20.49,2.68
USBD_N
  Bottom 0.254: U$6.D_N 7.41,16.35 6.95,15.89 1.8,15.89 1.61,15.89 U$5.USBD_N
USBD_P
  Bottom 0.254: U$6.D_P 7.41,15.08 6.95,15.55 1.65,15.55 0.84,15.55 U$5.USBD_P
V_LIPO  (via drill 0.2)
  Top 0.203: 16.41,17.71 17.16,16.96 17.92,16.96
  Top 0.254: v20.07,15.75 20.07,16 | 19.5,16.57 U$3.3 | 15.02,17.71 16.41,17.71
  Top 0.305: 14.34,17.71 15.02,17.71
  Top 0.406: 17.92,16.96 19.48,16.96 U$3.3 | 20.07,16 19.5,16.57 | U$1.3 14.34,17.72 14.34,17.71
  Bottom 0.254: X2.2 | X2.2 23.16,2.88 22.46,3.58 22.46,11.01 21.32,12.15 U$2.1 20.09,13.7 20.09,15.75 v20.07,15.75
V_USB  (via drill 0.2)
  Top 0.2: 15.99,19.85 v15.96,19.88
  Top 0.254: 22.54,13.2 22.61,13.14 v22.61,13.09
  Top 0.406: 15.99,19.21 D1.A 15.26,18.89 11.19,18.89 10.02,17.72 U$1.4 8.75,17.72 7.36,19.11 C2.1 6.91,19.12 C1.1 3.07,19.12 1.96,18.01 U$5.V_USB | 15.99,19.21 R6.2 17.21,18.08 U$3.1 20.37,17.89 21.07,17.19 21.07,14.63 22.49,13.2 22.54,13.2 | 1.92,18.01 2.16,17.77 2.16,12.37 0.41,10.62 0.41,7.8 YELLOW.A | 15.99,19.21 15.99,19.85
  Top 0.508: 1.92,18.01 U$5.V_USB
  Bottom 0.2: 15.96,19.04 C5.1
  Bottom 0.254: C3.1 16.12,15.1 15.37,15.85 15.37,18.13 15.96,18.72 v15.96,19.88 | 25,8.65 25,9.46 25,10.56 24.38,11.18 23.09,11.18 22.59,11.68 22.59,13.07 v22.61,13.09
  Bottom 0.305: C3.1 15.43,15.08 15.28,15.08 | C5.1 16.11,18.88 | 25,8.65 23.86,7.51 U$2.4
  Bottom 0.406: 16.11,18.88 15.18,18.88 | v15.96,19.88 15.96,19.04
  Bottom 0.508: 15.28,15.08 15.1,15.08 U$6.V3 | 15.18,18.88 U$6.VCC
VBATT
  Top 0.2: 8.91,1.27 9.05,1.41 | 15.75,1.41 16.1,1.06
  Top 0.254: D2.2 5.89,7.83 5.54,7.48 5.54,4.92 5.82,4.64 5.82,1.81 6.35,1.27 8.91,1.27 | 9.05,1.41 15.75,1.41 | 16.1,1.06 20.41,1.06 21.27,1.92 22.57,1.92 23.16,1.92 1.55V-8MAH.2+
  Top 0.305: 22.57,1.92 22.57,2.53 21.6,3.5 21.6,5.98 22.75,7.13 22.75,8.05 22.89,8.2 1.55V-8MAH.1+
VCC  (via drill 0.2)
  Top 0.2: U3.4 18.38,5.12 18.43,5.12 | D2.1 7.88,8.46 | 9.04,8.46 v9.08,8.5 | R5.1 11.21,9.39 | v19.58,4.29 19.58,4.3 C7.1
  Top 0.254: 18.43,5.12 18.68,5.12 18.71,5.1 | 11.16,11.32 11.16,13.79 12.7,15.32
  Top 0.305: 18.71,5.1 18.92,4.88 C7.1 | 17.21,15.8 U$3.2 | 11.31,11.17 11.16,11.32 | 12.7,15.32 D1.C
  Top 0.406: 17.21,15.8 C4.1 16.11,14.67 D1.C | D2.1 7.79,7.47 8.32,6.94 R7.1 | R4.1 R5.1 11.31,11.17 | C7.1 | 7.88,8.46 9.04,8.46 | 11.21,9.39 v10.13,9.39 | v18.88,15.69 18.59,15.99 U$3.2
  Bottom 0.2: v9.08,8.5 9.82,8.5 10.13,8.81 v10.13,9.39 | U$2.3 21.32,7.33 21.95,6.7 21.95,3.57 21.61,3.22 19.86,3.22 19.56,3.52 19.56,4.26 v19.58,4.29
  Bottom 0.254: v18.88,15.69 18.88,15.73 19.58,15.03 19.58,8.98 21.17,7.4 U$2.3
VDD1
  Top 0.254: 6.96,7.25 6.97,7.26 6.97,9.45 7.14,9.62 9.08,9.62 9.55,9.15 9.55,8.92 9.98,8.48 C6.1
  Top 0.305: C6.1 10.44,7.17 U4.3 | D2.3 6.84,7.13 6.96,7.25

### Text on the board
tPlace: - | +
bPlace: P1 | P4 | P2 | P5 | P3 | P6